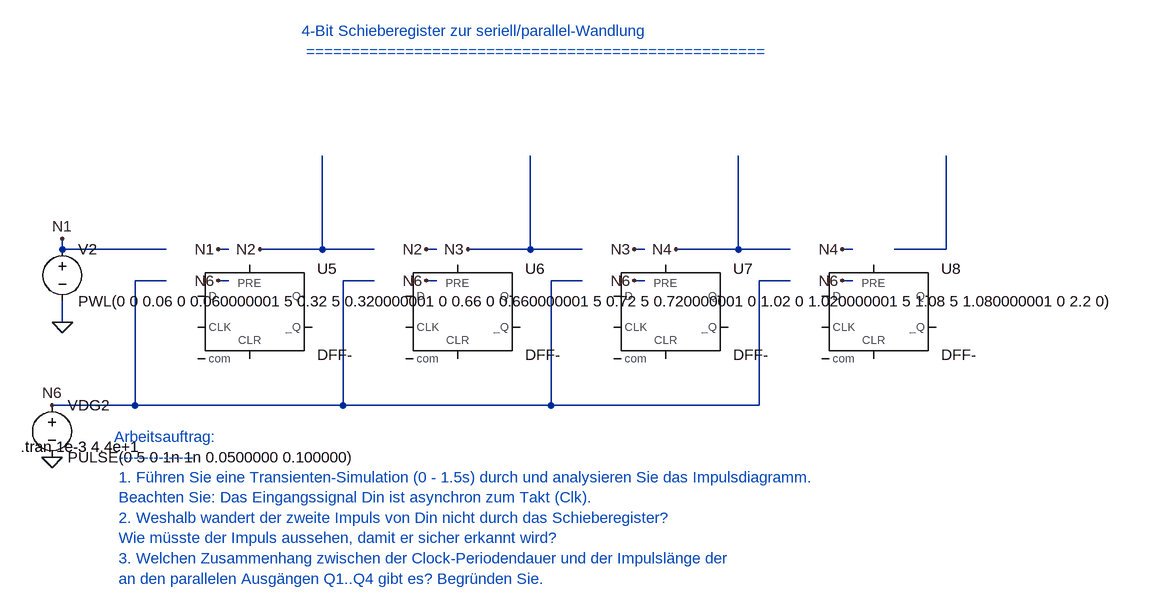
[diagram p0: schematic 6_3_1_Schieberegister_Prinzip (1).asc]
6_3_1_Schieberegister_Prinzip (1).asc, the LTspice schematic file:
Version 4
SHEET 1 880 680
WIRE 128 528 128 544
WIRE 448 448 528 448
WIRE 1088 448 1168 448
WIRE 528 448 608 448
WIRE 528 304 528 448
WIRE 768 448 848 448
WIRE 1168 448 1248 448
WIRE 1168 304 1168 448
WIRE 1488 304 1488 448
WIRE 1488 448 1408 448
WIRE 848 448 928 448
WIRE 848 304 848 448
WIRE 112 688 240 688
WIRE 240 688 240 496
WIRE 240 496 288 496
WIRE 608 496 560 496
WIRE 560 496 560 688
WIRE 560 688 240 688
WIRE 1248 496 1200 496
WIRE 1200 496 1200 688
WIRE 1200 688 880 688
WIRE 880 688 560 688
WIRE 928 496 880 496
WIRE 880 496 880 688
WIRE 128 560 128 544
WIRE 128 448 288 448
WIRE 704 448 688 448
WIRE 448 448 432 448
WIRE 1024 448 1008 448
WIRE 768 448 752 448
WIRE 1344 448 1328 448
WIRE 1088 448 1072 448
WIRE 1344 496 1328 496
WIRE 704 496 688 496
WIRE 384 496 368 496
WIRE 1024 496 1008 496
WIRE 128 448 128 432
WIRE 384 448 368 448
FLAG 112 768 0
FLAG 128 560 0
FLAG 688 448 N2
FLAG 432 448 N2
FLAG 1008 448 N3
FLAG 752 448 N3
FLAG 1328 448 N4
FLAG 1072 448 N4
FLAG 1328 496 N6
FLAG 688 496 N6
FLAG 368 496 N6
FLAG 112 688 N6
FLAG 1008 496 N6
FLAG 128 432 N1
FLAG 368 448 N1
SYMBOL Digital\dflop 416 472 R0
SYMATTR InstName U5
SYMATTR Value DFF-
SYMATTR LibreSpice kind=dff;edge=falling;async=high;vth=2.5;vhigh=5;pins=D,CLK,SET,RESET,Q,~Q
SYMBOL Digital\dflop 736 472 R0
SYMATTR InstName U6
SYMATTR Value DFF-
SYMATTR LibreSpice kind=dff;edge=falling;async=high;vth=2.5;vhigh=5;pins=D,CLK,SET,RESET,Q,~Q
SYMBOL Digital\dflop 1056 472 R0
SYMATTR InstName U7
SYMATTR Value DFF-
SYMATTR LibreSpice kind=dff;edge=falling;async=high;vth=2.5;vhigh=5;pins=D,CLK,SET,RESET,Q,~Q
SYMBOL Digital\dflop 1376 472 R0
SYMATTR InstName U8
SYMATTR Value DFF-
SYMATTR LibreSpice kind=dff;edge=falling;async=high;vth=2.5;vhigh=5;pins=D,CLK,SET,RESET,Q,~Q
SYMBOL voltage 112 672 R0
SYMATTR InstName VDG2
SYMATTR Value PULSE(0 5 0 1n 1n 0.0500000 0.100000)
SYMBOL voltage 128 432 R0
SYMATTR InstName V2
SYMATTR Value PWL(0 0 0.06 0 0.060000001 5 0.32 5 0.320000001 0 0.66 0 0.660000001 5 0.72 5 0.720000001 0 1.02 0 1.020000001 5 1.08 5 1.080000001 0 2.2 0)
TEXT 64 752 Left 2 !.tran 1e-3 4.4e+1
TEXT 496 112 Left 2 ;4-Bit Schieberegister zur seriell/parallel-Wandlung \n ===================================================
TEXT 208 736 Left 2 ;Arbeitsauftrag: \n --------------- \n 1. Führen Sie eine Transienten-Simulation (0 - 1.5s) durch und analysieren Sie das Impulsdiagramm. \n Beachten Sie: Das Eingangssignal Din ist asynchron zum Takt (Clk). \n 2. Weshalb wandert der zweite Impuls von Din nicht durch das Schieberegister? \n Wie müsste der Impuls aussehen, damit er sicher erkannt wird? \n 3. Welchen Zusammenhang zwischen der Clock-Periodendauer und der Impulslänge der \n an den parallelen Ausgängen Q1..Q4 gibt es? Begründen Sie.

The netlist it stands for:
* 6_3_1_Schieberegister_Prinzip (1).asc
A§U5 0 0 0 0 0 0 0 0 DFLOP DFF-
A§U6 0 0 0 0 0 0 0 0 DFLOP DFF-
A§U7 0 0 0 0 0 0 0 0 DFLOP DFF-
A§U8 0 0 0 0 0 0 0 0 DFLOP DFF-
VDG2 N6 0 PULSE(0 5 0 1n 1n 0.0500000 0.100000)
V2 N1 0 PWL(0 0 0.06 0 0.060000001 5 0.32 5 0.320000001 0 0.66 0 0.660000001 5 0.72 5 0.720000001 0 1.02 0 1.020000001 5 1.08 5 1.080000001 0 2.2 0)
.tran 1e-3 4.4e+1
* 4-Bit Schieberegister zur seriell/parallel-Wandlung
*  ===================================================
* Arbeitsauftrag:
*  ---------------
*  1. Führen Sie eine Transienten-Simulation (0 - 1.5s) durch und analysieren Sie das Impulsdiagramm.
*  Beachten Sie: Das Eingangssignal Din ist asynchron zum Takt (Clk).
*  2. Weshalb wandert der zweite Impuls von Din nicht durch das Schieberegister?
*  Wie müsste der Impuls aussehen, damit er sicher erkannt wird?
*  3. Welchen Zusammenhang zwischen der Clock-Periodendauer und der Impulslänge der
*  an den parallelen Ausgängen Q1..Q4 gibt es? Begründen Sie.
.backanno
.end